# Altium schematic sheet QCopterFC_CAM_Sch.SchDoc
size A4
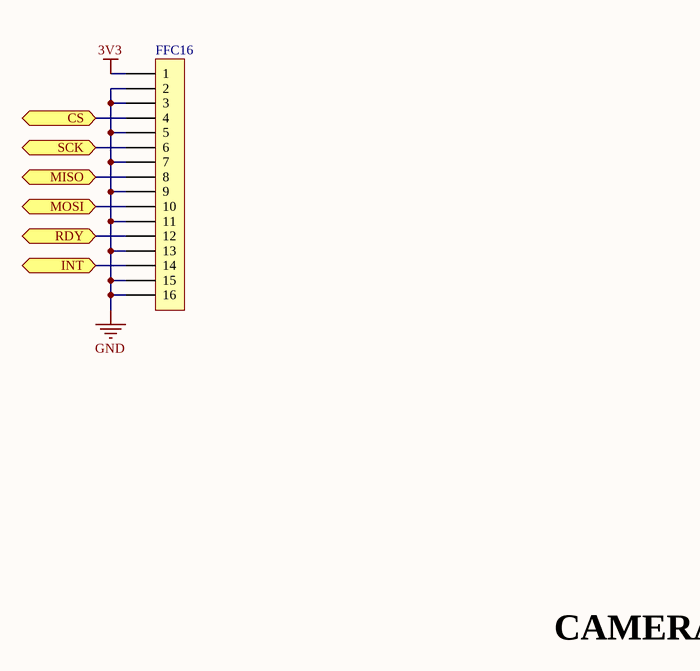
[diagram p0: QCopterFC_CAM_Sch.SchDoc]

## Parts
FFC16  FFC_0.5_16  [FFC_0.5_16]  (value not drawn)

## Ports
CS, INT, MISO, MOSI, RDY, SCK

## Nets
3V3: FFC16.1
GND: FFC16.2 FFC16.3 FFC16.5 FFC16.7 FFC16.9 FFC16.11 FFC16.13 FFC16.15 FFC16.16
CS: FFC16.4 ; port CS
INT: FFC16.14 ; port INT
MISO: FFC16.8 ; port MISO
MOSI: FFC16.10 ; port MOSI
RDY: FFC16.12 ; port RDY
SCK: FFC16.6 ; port SCK

## Notes on the sheet
- CAMERA

## Library data of the parts
FFC16 = FFC_0.5_16: FFC